# Altium schematic sheet IC_Programmers.SchDoc
size A3; SheetNumber: 2; SheetTotal: 3
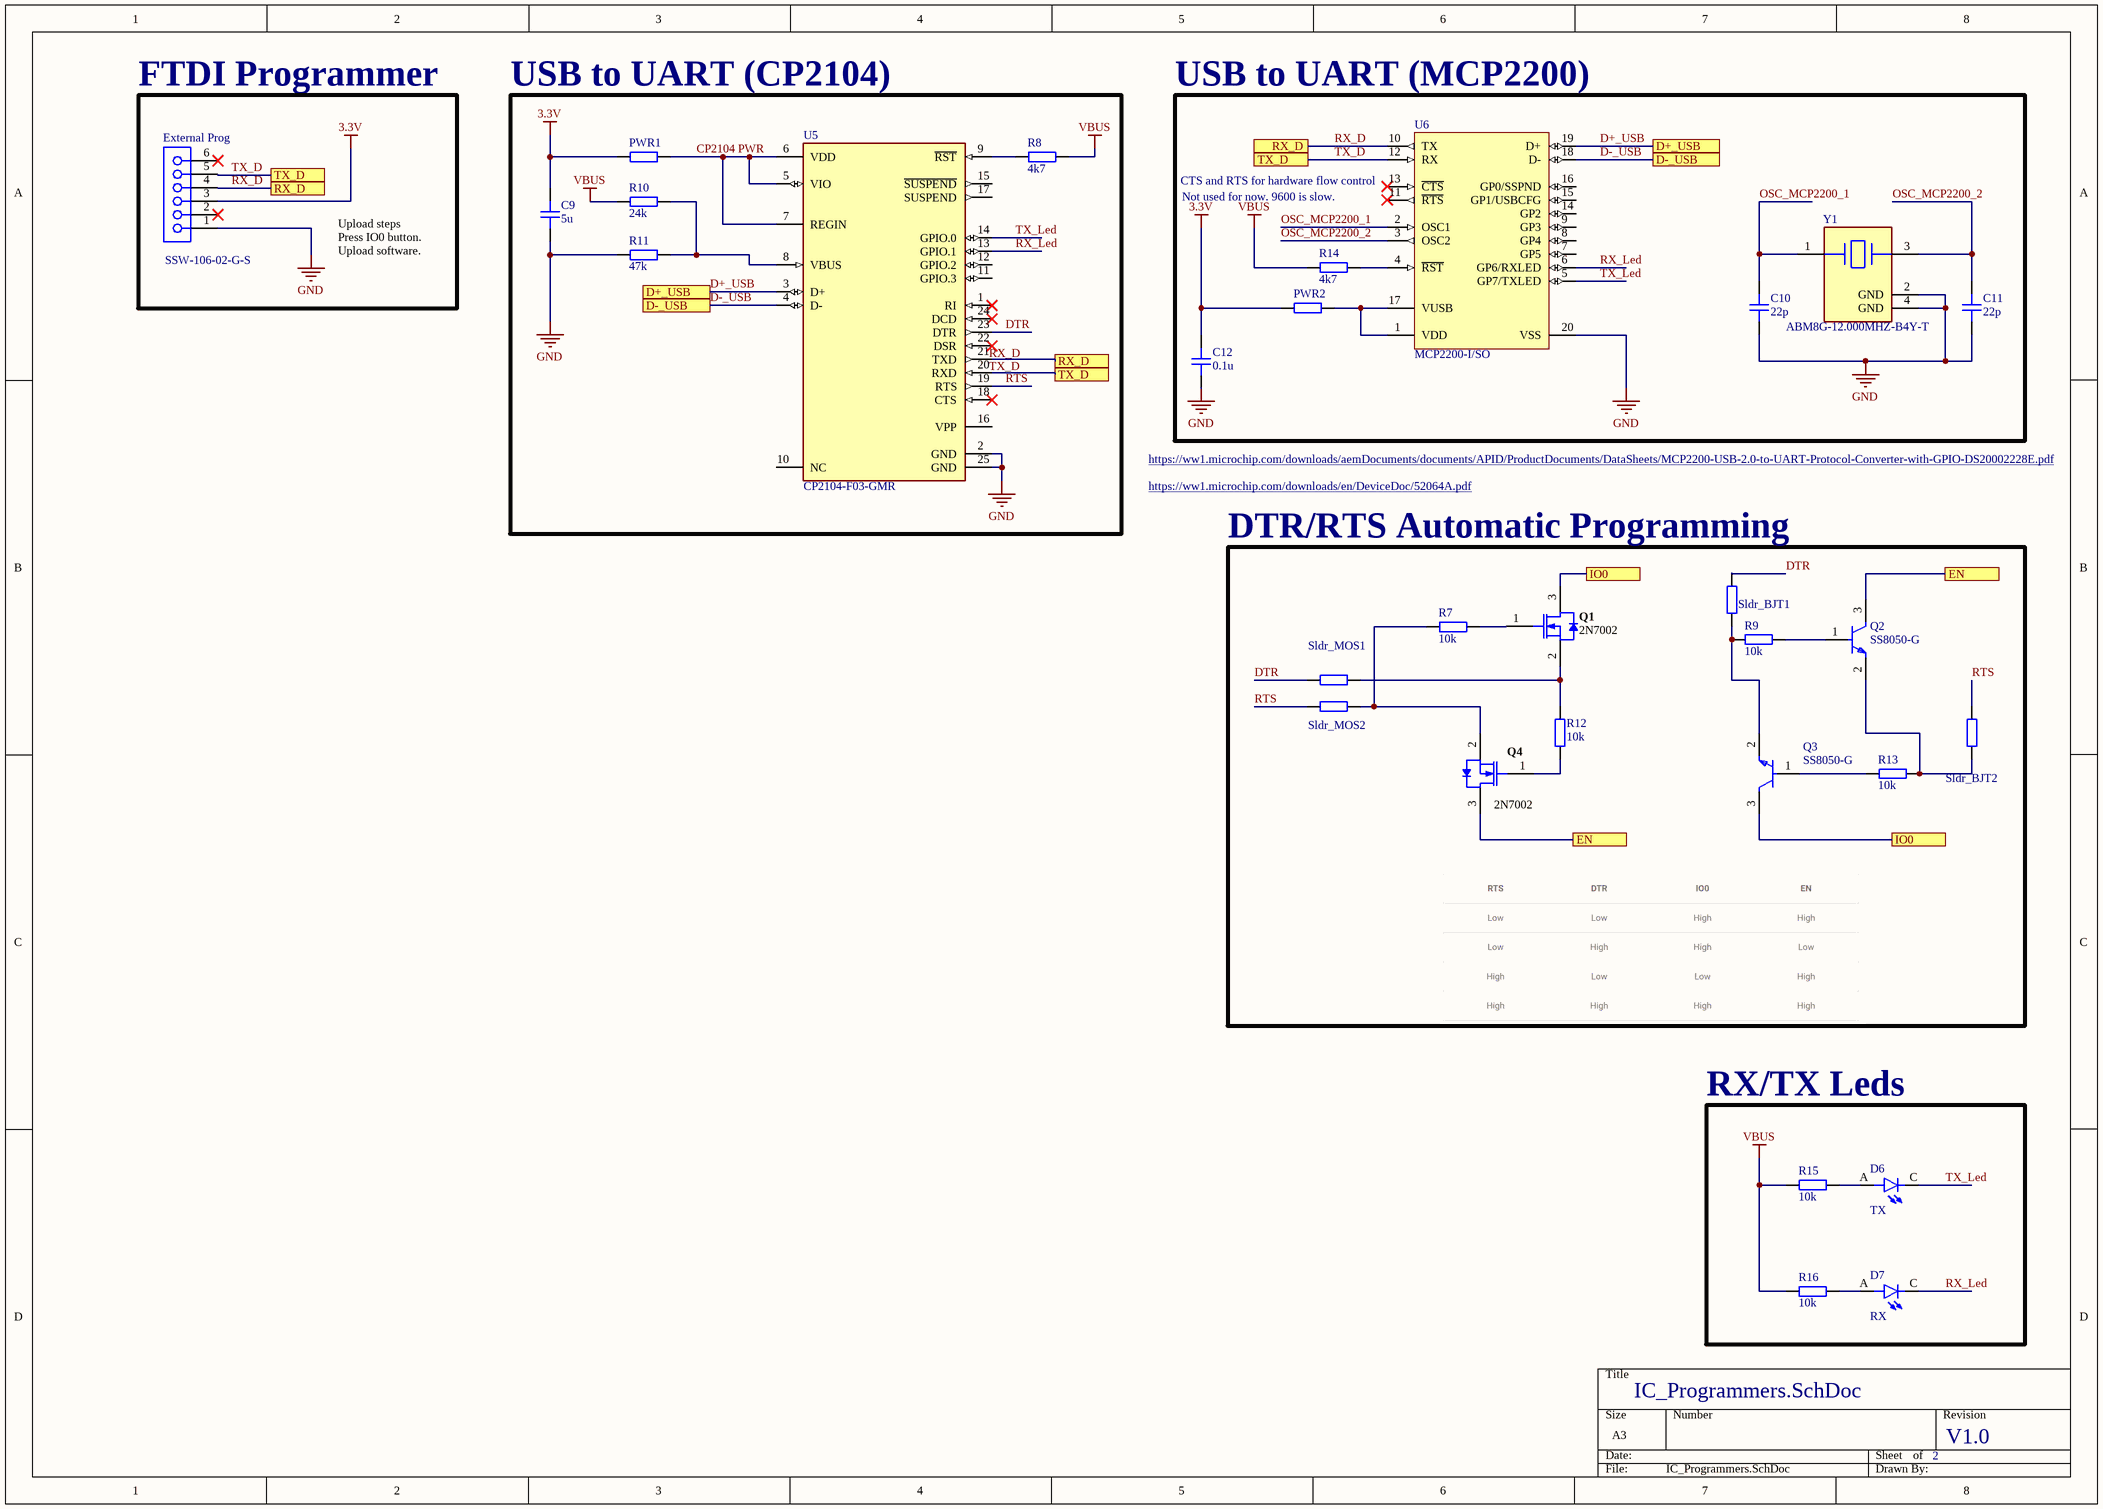
[diagram p0: IC_Programmers.SchDoc]

## Parts
C9  5u  [CAP_1206]
C10  22p  [CAP_1206]
C11  22p  [CAP_1206]
C12  0.1u  [CAP_1206]
D6  TX  [LED_1206]
D7  RX  [LED_1206]
External_Prog  SSW-106-02-G-S  [SMTC-SSW-106-02-X-S]
PWR1  Solder Pin CP2104  [RES_1206]  (value not drawn)
PWR2  Solder MCP2200  [RES_1206]  (value not drawn)
Q1  2N7002  [INF-PG-SOT23_M]
Q2  SS8050-G  [FP-SS8050-G-MFG]
Q3  SS8050-G  [FP-SS8050-G-MFG]
Q4  2N7002  [INF-PG-SOT23_M]
R7  10k  [RES_1206]
R8  4k7  [RES_1206]
R9  10k  [RES_1206]
R10  24k  [RES_1206]
R11  47k  [RES_1206]
R12  10k  [RES_1206]
R13  10k  [RES_1206]
R14  4k7  [RES_1206]
R15  10k  [RES_1206]
R16  10k  [RES_1206]
Sldr_BJT1  R0603  [RES_0603]  (value not drawn)
Sldr_BJT2  R0603  [RES_0603]  (value not drawn)
Sldr_MOS1  R0603  [RES_0603]  (value not drawn)
Sldr_MOS2  R0603  [RES_0603]  (value not drawn)
U5  CP2104-F03-GMR  [FP-CP2104-F03-GMR-MFG]
U6  MCP2200-I/SO  [SOIC-SO20_M]
Y1  ABM8G-12.000MHZ-B4Y-T  [FP-ABM8G-MFG]

## Blocks framed on the sheet
FTDI Programmer: External_Prog
USB to UART (CP2104): C9 PWR1 R8 R10 R11 U5
USB to UART (MCP2200): C10-C12 PWR2 R14 U6 Y1
DTR/RTS Automatic Programming: Q1-Q4 R7 R9 R12 R13 Sldr_BJT1 Sldr_BJT2 Sldr_MOS1 Sldr_MOS2
RX/TX Leds: D6 D7 R15 R16

## Ports
D+_USB (see IC_Programmers[3A], IC_Schema[2A]), D+_USB (see IC_Programmers[7A], IC_Schema[2A]), D-_USB (see IC_Programmers[3A], IC_Schema[2A]), D-_USB (see IC_Programmers[7A], IC_Schema[2A]), EN (see IC_Programmers[6C], IC_Schema[5A]), EN (see IC_Programmers[8B], IC_Schema[5A]), IO0 (see IC_Programmers[7B], IC_Schema[5B], IC_Schema[8A]), IO0 (see IC_Programmers[8C], IC_Schema[5B], IC_Schema[8A]), RX_D (see IC_Programmers[2A], IC_Programmers[5A], IC_Schema[6A]), RX_D (see IC_Programmers[5A], IC_Schema[6A]), TX_D (see IC_Programmers[2A], IC_Programmers[5A], IC_Schema[6A]), TX_D (see IC_Programmers[5A], IC_Schema[6A])

## Nets
3.3V: C9.2 C12.2 External_Prog.3 PWR1.1 PWR2.1
GND: C9.1 C10.1 C11.1 C12.1 External_Prog.1 R11.1 U5.2(GND) U5.25(GND) U6.20(VSS) Y1.2(GND) Y1.4(GND)
VBUS: R8.1 R10.1 R14.1 R15.1 R16.1
CP2104 PWR: PWR1.2 U5.5(VIO) U5.6(VDD) U5.7(REGIN)
D+_USB: U5.3(D+) U6.19(D+) ; port D+_USB
D-_USB: U5.4(D-) U6.18(D-) ; port D-_USB
DTR: Sldr_BJT1.2 Sldr_MOS1.2 U5.23(DTR)
EN: Q2.3(C) Q4.3(DRAIN) ; port EN
IO0: Q1.3(DRAIN) Q3.3(C) ; port IO0
OSC_MCP2200_1: C10.2 U6.2(OSC1) Y1.1
OSC_MCP2200_2: C11.2 U6.3(OSC2) Y1.3
RTS: Sldr_BJT2.2 Sldr_MOS2.2 U5.19(RTS)
RX_D: External_Prog.4 U5.21(TXD) U6.10(TX) ; port RX_D
RX_Led: D7.C U5.13(GPIO.1) U6.6(GP6/RXLED)
TX_D: External_Prog.5 U5.20(RXD) U6.12(RX) ; port TX_D
TX_Led: D6.C U5.14(GPIO.0) U6.5(GP7/TXLED)
NetD6_A: D6.A R15.2
NetD7_A: D7.A R16.2
NetPWR2_2: PWR2.2 U6.1(VDD) U6.17(VUSB)
NetQ1_1: Q1.1(GATE) R7.2
NetQ1_2: Q1.2(SOURCE) R12.1 Sldr_MOS1.1
NetQ2_1: Q2.1(B) R9.1
NetQ2_2: Q2.2(E) R13.2 Sldr_BJT2.1
NetQ3_1: Q3.1(B) R13.1
NetQ3_2: Q3.2(E) R9.2 Sldr_BJT1.1
NetQ4_1: Q4.1(GATE) R12.2
NetQ4_2: Q4.2(SOURCE) R7.1 Sldr_MOS2.1
NetR8_2: R8.2 U5.9(~{RST})
NetR10_2: R10.2 R11.2 U5.8(VBUS)
NetR14_2: R14.2 U6.4(~{RST})

Not connected (* = marked no-connect by the designer): External_Prog 2* 6*; U5 1(RI)* 10(NC) 11(GPIO.3) 12(GPIO.2) 15(~{SUSPEND}) 16(VPP) 17(SUSPEND) 18(CTS)* 22(DSR)* 24(DCD)*; U6 7(GP5) 8(GP4) 9(GP3) 11(~{RTS})* 13(~{CTS})* 14(GP2) 15(GP1/USBCFG) 16(GP0/SSPND)

## Notes on the sheet
- (near U6) CTS and RTS for hardware flow control
- Not used for now. 9600 is slow.
- Upload steps
  Press IO0 button.
  Upload software.
- https://ww1.microchip.com/downloads/aemDocuments/documents/APID/ProductDocuments/DataSheets/MCP2200-USB-2.0-to-UART-Protocol-Converter-with-GPIO-DS20002228E.pdf
- https://ww1.microchip.com/downloads/en/DeviceDoc/52064A.pdf
- V1.0
- Labels drawn without touching a wire or pin: RX_D, TX_D

## Library data of the parts
C9-C12 = CAP_1206_50V: Capacitor SMD 1206 50V
D6 D7 = LED - 1206: Yellow 587nm LED Indication - Discrete 2V 1206 _3216 Metric_; MF: Lite-On Inc.; MP: LTST-C230KSKT; Value: *; SnapEDA_Link: https://www.snapeda.com/parts/LTST-C230KSKT/Lite-On%20Inc./view-part/264912/?ref=snap; Availability: Unavailable; Package: 1206 Lite-On; Price: None
External_Prog = CMP-1023-00359-1: SQ Post Socket, Through-hole, Vertical, -55 to 125 degC, 2.54mm Pitch, 6-Pin, Female, RoHS; Manufacturer: Samtec; ComponentLink1Description: Manufacturer URL; Pitch: 2.54 mm; ComponentLink1URL: http://www.samtec.com; ComponentLink2Description: Datasheet; PackageVersion: CA, 6/1987; Orientation: Vertical; RoHS: True; PackageReference: SSW-106-02-X-S; ComponentLink2URL: http://www.samtec.com/documents/webfiles/pdf/SSW_TH.PDF; Mounting Technology: Through-hole; Temperature Range: -55 to 125 degC; PackageDescription: Assembly, Socket Strip .016 X .031 Tail; DatasheetVersion: F-214; ComponentLink3Description: Package Specification; PartNumber: SSW-106-02-G-S; ComponentLink3URL: http://www.samtec.com/documents/webfiles/cpdf/SSW-1XX-XX-XXX-X-XX-XXX-XX-MKT.pdf
PWR1 PWR2 R7-R16 = RES_1206: Resistor SMD 1206
Q1 Q4 = CMP-1149-00026-1: N-Channel OptiMOS Small-Signal-Transistor, 60 V VDS, 0.3 A ID, -55 to 150 degC, PG-SOT23, Reel, Green; Manufacturer: Infineon; RDS (on) (max) (@4.5V): 4,000 mOhm; VDS (max): 60 V; IDpuls (max): 1.2Â A; QG: 0.4Â nC; RDS (on) (max): 3,000 mOhm; RthJA (max): 250 K/W; ID (max): 0.3Â A; VGS(th) (max): 2.5Â V; VGS(th) (min): 1.5Â V; Green: TRUE; Ptot (max): 0.5Â W; PackageDescription: 3-Pin Small Outline Transistor Package, 2.9 x 1.3 mm Body, 0.95 mm Pitch; Halogen-free: TRUE; ComponentLink2Description: Datasheet; ComponentLink1URL: http://www.infineon.com/; Packing: Reel; DatasheetVersion: Rev. 2.4; PartNumber: 2N7002; PackageReference: PG-SOT23; PackageVersion: Apr-08; ComponentLink3URL: http://www.infineon.com/dgdl/SOT23-Package_Overview.pdf?folderId=db3a30431936bc4b0119532290053c66&fileId=db3a30431936bc4b0119533468123c85; ComponentLink1Description: Manufacturer URL; Mounting Technology: Surface Mount; ComponentLink3Description: Package Specification; ComponentLink2URL: http://www.infineon.com/dgdl/2N7002_Rev2.4.pdf?folderId=db3a3043156fd573011622e10b5c1f67&fileId=db3a304319bc939a0119c2a9461e79e6
Q2 Q3 = CMP-20235-000001-1: NPN TRANSISTOR 1.5A 40V SOT-23 R; Transition Frequency: 100MHz; Max Breakdown Voltage: 25V; Collector Emitter Voltage (VCEO): 400mV; Max Power Dissipation: 300mW; Max Collector Current: 1.5A; Case/Package: TO-236-3; Packaging: Tape and Reel; RoHS Compliant: Yes; Mount: Surface Mount; Collector Emitter Breakdown Voltage: 25V
Sldr_BJT1 Sldr_BJT2 Sldr_MOS1 Sldr_MOS2 = RES_0603: Resistor SMD 0603
U5 = CMP-08107-000004-1: IC SGL USB-TO-UART BRIDGE 24QFN; Manufacturer: Silicon Laboratories; Max Supply Voltage: 3.6V; Min Supply Voltage: 1.8V; Nominal Supply Current: 100-17000uA; Standoff Height: 0mm; Interface: UART,USB; Temperature Range Low: -40°C; Lead Free: Yes; Device Class L3: Controllers; Ambient Temperature Range Low: -55°C; Automotive: No; Category: IC; Temperature: -40°C to +85°C; Octopart: https://octopart.com/cp2104-f03-gmr-silicon+labs-19668642; Ambient Temperature Range High: +125°C; Package: CP2104-F03-GMR; Device Class L2: Interface ICs; Digikey Description: IC SGL USB-TO-UART BRIDGE 24QFN; Device Class L1: Integrated Circuits (ICs); Manufacturer Part Number: CP2104-F03-GMR; Temperature Range High: +85°C; ComponentLink2URL: https://www.silabs.com/documents/public/data-sheets/cp2104.pdf; Height: 0.8mm; Ipc Land Pattern Name: QFN50P400X400X75-24; Mouser Description: I/O Controller Interface IC USB to UART bridge; ComponentLink2Description: Datasheet; RoHS: TRUE
U6 = CMP-0186-00205-1: USB 2.0 to UART Protocol Converter with GPIO, 20-Pin SOIC, Industrial Temperature; ComponentLink1Description: Manufacturer URL; ComponentLink2URL: http://ww1.microchip.com/downloads/en/DeviceDoc/22228B.pdf; ComponentLink2Description: Datasheet; PackageDescription: 20-Lead Plastic Small Outline (SO) - Wide 7.50mm Body [SOIC]; ComponentLink3URL: http://www.microchip.com/stellent/groups/techpub_sg/documents/packagingspec/en012702.pdf; DatasheetVersion: revB, Mar-2011; PackageVersion: revBB, Aug-2009; PackageReference: SOIC-SO20; Code_IPC: SOIC127P1030-20; ComponentLink3Description: Package Specification; Code_JEDEC: MS-013-AC; ComponentLink1URL: http://www.microchip.com/
Y1 = CMP-27762-015546-1: Crystal 12MHz ±30ppm (Tol) ±30ppm (Stability) 10pF FUND 120Ω 4-Pin SMD T/R; ESR (Equivalent Series Resistance): 120R; Height: 1mm; Operating Frequency: 12 MHz; Case/Package: CSMD; Max Operating Temperature: 70°C; Load Capacitance: 10pF; Series: ABM8G; Depth: 2.5mm; Package Quantity: 1000; Frequency: 12MHz; Min Operating Temperature: -20°C; Length: 3.2mm; Termination: SMD/SMT; Frequency Tolerance: 30ppm; Frequency Stability: 30ppm; Tolerance: 30ppm; Lead Free: Lead Free; Number of Pins: 4; Mount: Surface Mount; Width: 2.5mm; Packaging: Tape and Reel